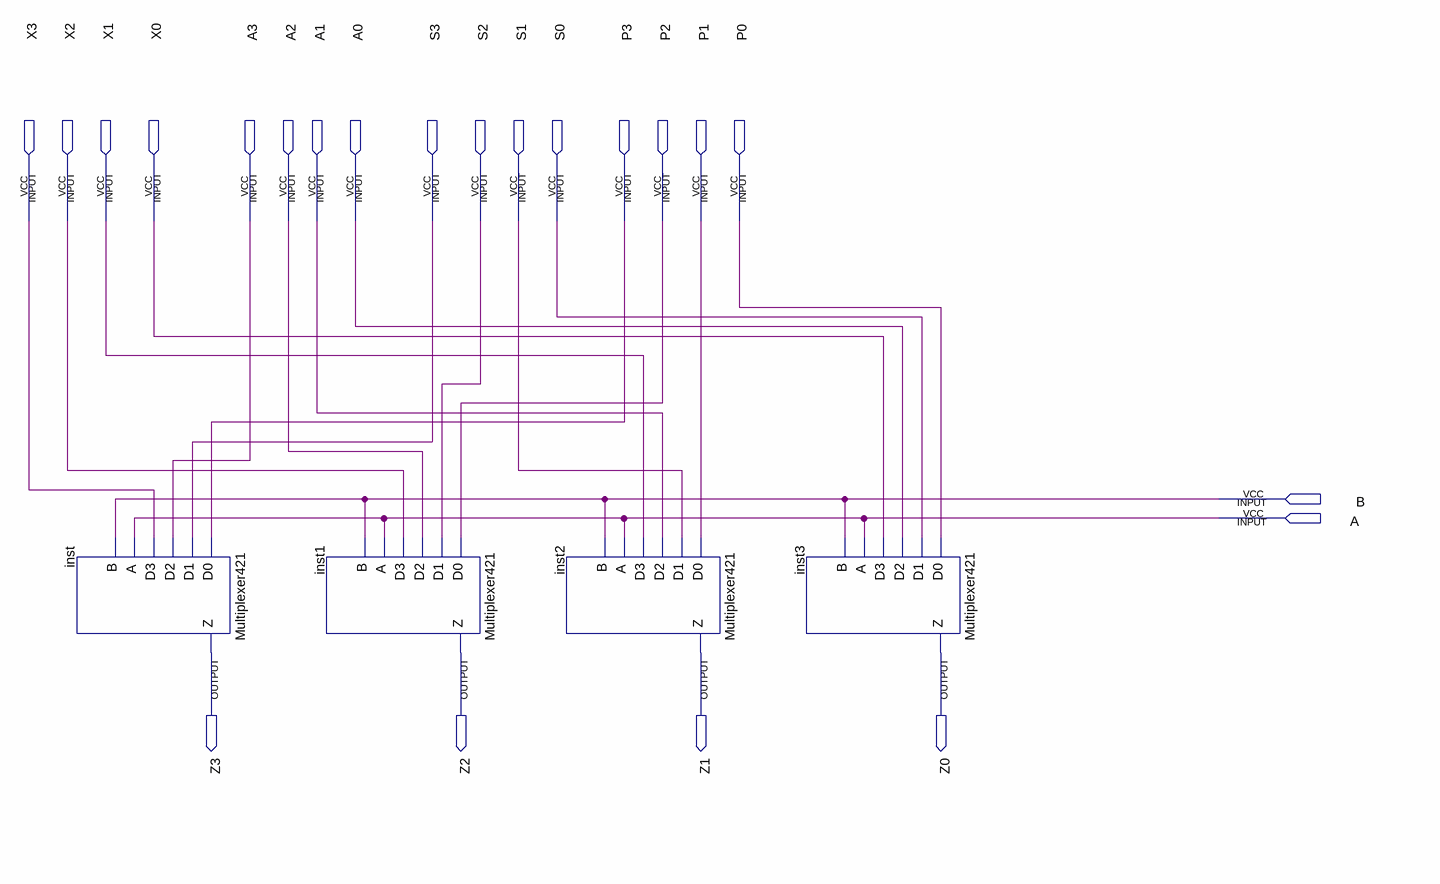
[diagram p0: schematic sheet]
// Quartus schematic ALUSelection.bdf as structural Verilog: 4 symbols, 22 pins
module ALUSelection (
  input  X3,
  input  X2,
  input  X1,
  input  X0,
  input  A3,
  input  A2,
  input  A1,
  input  A0,
  input  S3,
  input  S2,
  input  S1,
  input  S0,
  input  P3,
  input  P2,
  input  P1,
  input  P0,
  input  B,
  input  A,
  output Z3,
  output Z2,
  output Z1,
  output Z0
);

  Multiplexer421 inst (.D0(P3), .D1(S3), .D2(A3), .D3(X3), .A(A), .B(B), .Z(Z3));
  Multiplexer421 inst1 (.D0(P2), .D1(S2), .D2(A2), .D3(X2), .A(A), .B(B), .Z(Z2));
  Multiplexer421 inst2 (.D0(P1), .D1(S1), .D2(A1), .D3(X1), .A(A), .B(B), .Z(Z1));
  Multiplexer421 inst3 (.D0(P0), .D1(S0), .D2(A0), .D3(X0), .A(A), .B(B), .Z(Z0));
endmodule
